# Altium schematic sheet VDMEDA_Arduino.SchDoc
size A4
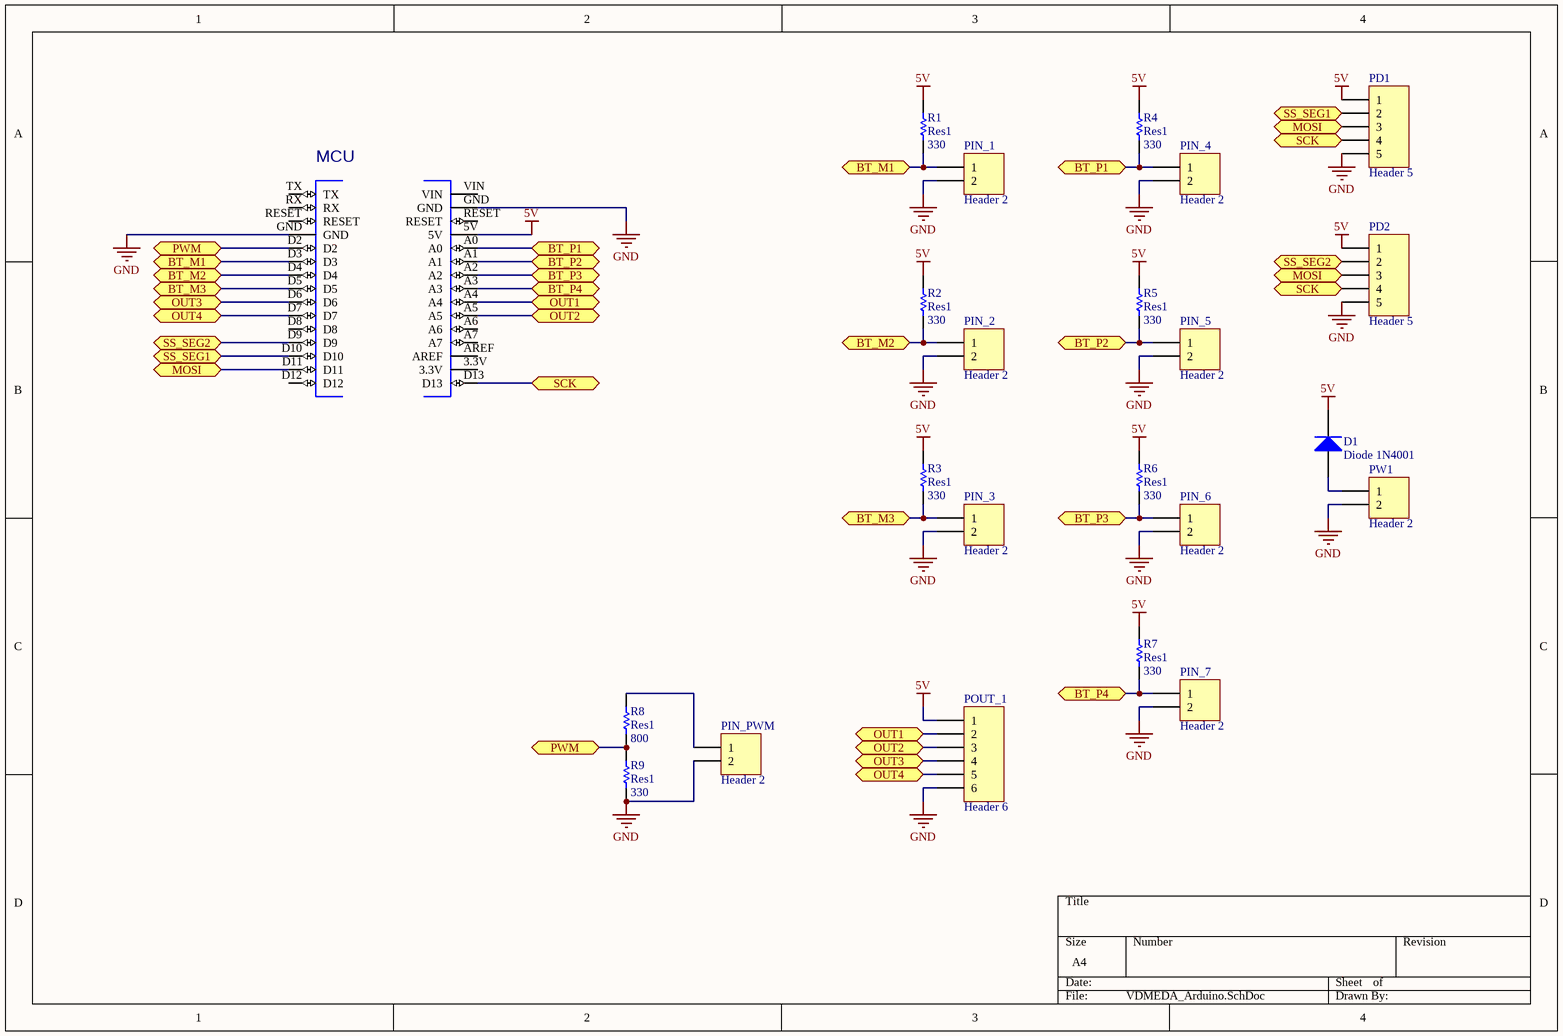
[diagram p0: VDMEDA_Arduino.SchDoc]

## Parts
D1  Diode 1N4001  [DO-41]
MCU  ARDUINO_NANO  [ARDUINO_NANO_ARDUINO_NANO(Primary)]  (value not drawn)
PD1  Header 5  [HDR1X5]
PD2  Header 5  [HDR1X5]
PIN_1  Header 2  [HDR1X2]
PIN_2  Header 2  [HDR1X2]
PIN_3  Header 2  [HDR1X2]
PIN_4  Header 2  [HDR1X2]
PIN_5  Header 2  [HDR1X2]
PIN_6  Header 2  [HDR1X2]
PIN_7  Header 2  [HDR1X2]
PIN_PWM  Header 2  [HDR1X2]
POUT_1  Header 6  [HDR1X6]
PW1  Header 2  [HDR1X2]
R1  Res1  value 330  [AXIAL-0.3]
R2  Res1  value 330  [AXIAL-0.3]
R3  Res1  value 330  [AXIAL-0.3]
R4  Res1  value 330  [AXIAL-0.3]
R5  Res1  value 330  [AXIAL-0.3]
R6  Res1  value 330  [AXIAL-0.3]
R7  Res1  value 330  [AXIAL-0.3]
R8  Res1  value 800  [AXIAL-0.3]
R9  Res1  value 330  [AXIAL-0.3]

## Ports
BT_M1 (bidir), BT_M2 (bidir), BT_M3 (bidir), BT_P1 (bidir), BT_P2 (bidir), BT_P3 (bidir), BT_P4 (bidir), MOSI (bidir), OUT1 (bidir), OUT2 (bidir), OUT3 (bidir), OUT4 (bidir), PWM (bidir), SCK (bidir), SS_SEG1 (bidir), SS_SEG2 (bidir)

## Nets
5V: D1.2(K) MCU.5V PD1.1 PD2.1 POUT_1.1 R1.2 R2.2 R3.2 R4.2 R5.2 R6.2 R7.2
GND: MCU.GND PD1.5 PD2.5 PIN_1.2 PIN_2.2 PIN_3.2 PIN_4.2 PIN_5.2 PIN_6.2 PIN_7.2 PIN_PWM.2 POUT_1.6 PW1.2 R9.1
BT_M1: MCU.D3 PIN_1.1 R1.1 ; port BT_M1
BT_M2: MCU.D4 PIN_2.1 R2.1 ; port BT_M2
BT_M3: MCU.D5 PIN_3.1 R3.1 ; port BT_M3
BT_P1: MCU.A0 PIN_4.1 R4.1 ; port BT_P1
BT_P2: MCU.A1 PIN_5.1 R5.1 ; port BT_P2
BT_P3: MCU.A2 PIN_6.1 R6.1 ; port BT_P3
BT_P4: MCU.A3 PIN_7.1 R7.1 ; port BT_P4
MOSI: MCU.D11 PD1.3 PD2.3 ; port MOSI
OUT1: MCU.A4 POUT_1.2 ; port OUT1
OUT2: MCU.A5 POUT_1.3 ; port OUT2
OUT3: MCU.D6 POUT_1.4 ; port OUT3
OUT4: MCU.D7 POUT_1.5 ; port OUT4
PWM: MCU.D2 R8.1 R9.2 ; port PWM
SCK: MCU.D13 PD1.4 PD2.4 ; port SCK
SS_SEG1: MCU.D10 PD1.2 ; port SS_SEG1
SS_SEG2: MCU.D9 PD2.2 ; port SS_SEG2
NetD1_1: D1.1(A) PW1.1
NetPIN_PWM_1: PIN_PWM.1 R8.2

Not connected (* = marked no-connect by the designer): MCU 3.3V A6 A7 AREF D8 D12 RESET RX TX VIN

## Library data of the parts
D1 = Diode 1N4001: 1 Amp General Purpose Rectifier; Published: 8-Jun-2000; LatestRevisionDate: 17-Jul-2002; LatestRevisionNote: Re-released for DXP Platform.; DatasheetVersion: 1998; PackageVersion: Aug-1999; PackageReference: DO-41; Publisher: Altium Limited; PackageDescription: Diode, Axial; Body 5.2 x 2.7 mm (LxDia. max), Lead Dia. 0.86 mm (max); Code_JEDEC: DO-204-AL; ComponentLink1Description: Manufacturer Link; ComponentLink1URL: http://www.fairchildsemi.com/; ComponentLink2Description: Datasheet; ComponentLink2URL: http://www.fairchildsemi.com/ds/1N%2F1N4001.pdf
PD1 PD2 = Header 5: Header, 5-Pin; LatestRevisionDate: 17-Jul-2002; LatestRevisionNote: Re-released for DXP Platform.; Publisher: Altium Limited
PIN_1-PIN_7 PIN_PWM PW1 = Header 2: Header, 2-Pin; LatestRevisionDate: 17-Jul-2002; LatestRevisionNote: Re-released for DXP Platform.; Publisher: Altium Limited
POUT_1 = Header 6: Header, 6-Pin; LatestRevisionDate: 17-Jul-2002; LatestRevisionNote: Re-released for DXP Platform.; Publisher: Altium Limited
R1-R9 = Res1: Resistor; Published: 8-Jun-2000; LatestRevisionDate: 17-Jul-2002; LatestRevisionNote: Re-released for DXP Platform.; PackageReference: AXIAL-0.3; Publisher: Altium Limited; PackageDescription: Axial Device, Thru-Hole; 2 Leads; 0.3 in Pin Spacing
MCU = ARDUINO_NANO: Value: *